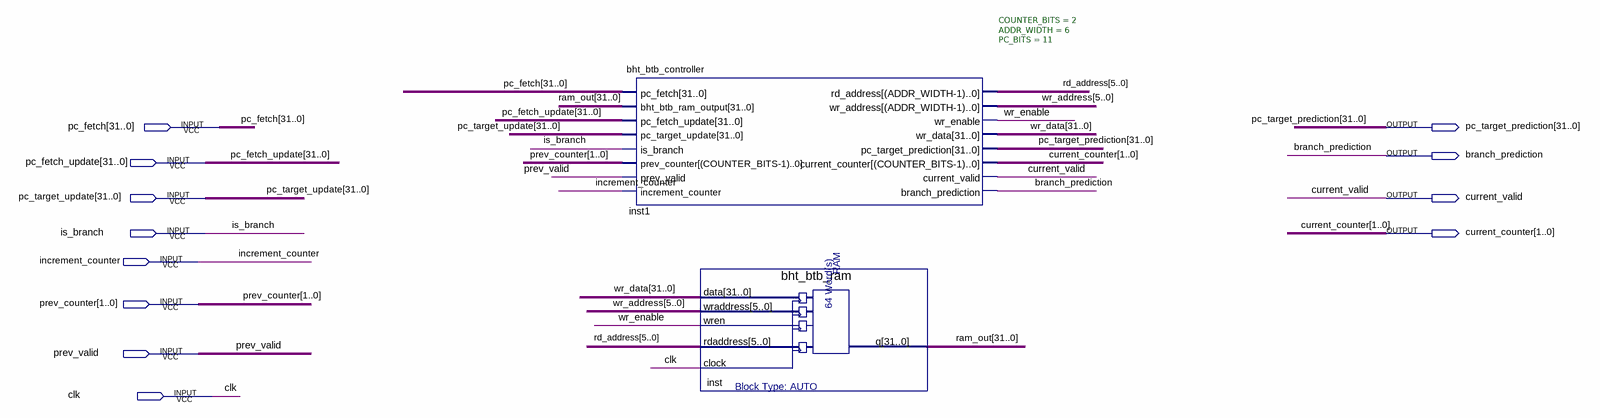
[diagram p0: schematic sheet]
// Quartus schematic bht_btb_module3.bdf as structural Verilog: 2 symbols, 12 pins
module bht_btb_module3 (
  input  [31:0] pc_fetch,
  input  [31:0] pc_fetch_update,
  input  [31:0] pc_target_update,
  input  is_branch,
  input  increment_counter,
  input  [1:0] prev_counter,
  input  prev_valid,
  input  clk,
  output [31:0] pc_target_prediction,
  output branch_prediction,
  output current_valid,
  output [1:0] current_counter
);

  wire wr_enable;
  wire [5:0] rd_address, wr_address;
  wire [31:0] ram_out, wr_data;

  bht_btb_controller #(.COUNTER_BITS(2), .ADDR_WIDTH(6), .PC_BITS(11)) inst1 (
    .pc_fetch(pc_fetch), .bht_btb_ram_output(ram_out), .pc_fetch_update(pc_fetch_update),
    .pc_target_update(pc_target_update), .is_branch(is_branch), .prev_counter(prev_counter),
    .prev_valid(prev_valid), .increment_counter(increment_counter), .rd_address(rd_address),
    .wr_address(wr_address), .wr_enable(wr_enable), .wr_data(wr_data),
    .pc_target_prediction(pc_target_prediction), .current_counter(current_counter),
    .current_valid(current_valid), .branch_prediction(branch_prediction));
  bht_btb_ram inst (
    .data(wr_data), .wraddress(wr_address), .wren(wr_enable), .rdaddress(rd_address), .clock(clk), .q(ram_out));
endmodule
